# Altium schematic sheet TOP_LEVEL.SchDoc: IGBT Driver
size 420 x 297 mm; ApprovedBy: Chefonov K. A.; Author: Chefonov K. A.; CompanyName: Xtronik; DrawnBy: Chefonov K. A.; Engineer: Chefonov K. A.; Organization: Xtronik; Revision: 1; SheetNumber: 1; SheetTotal: 3
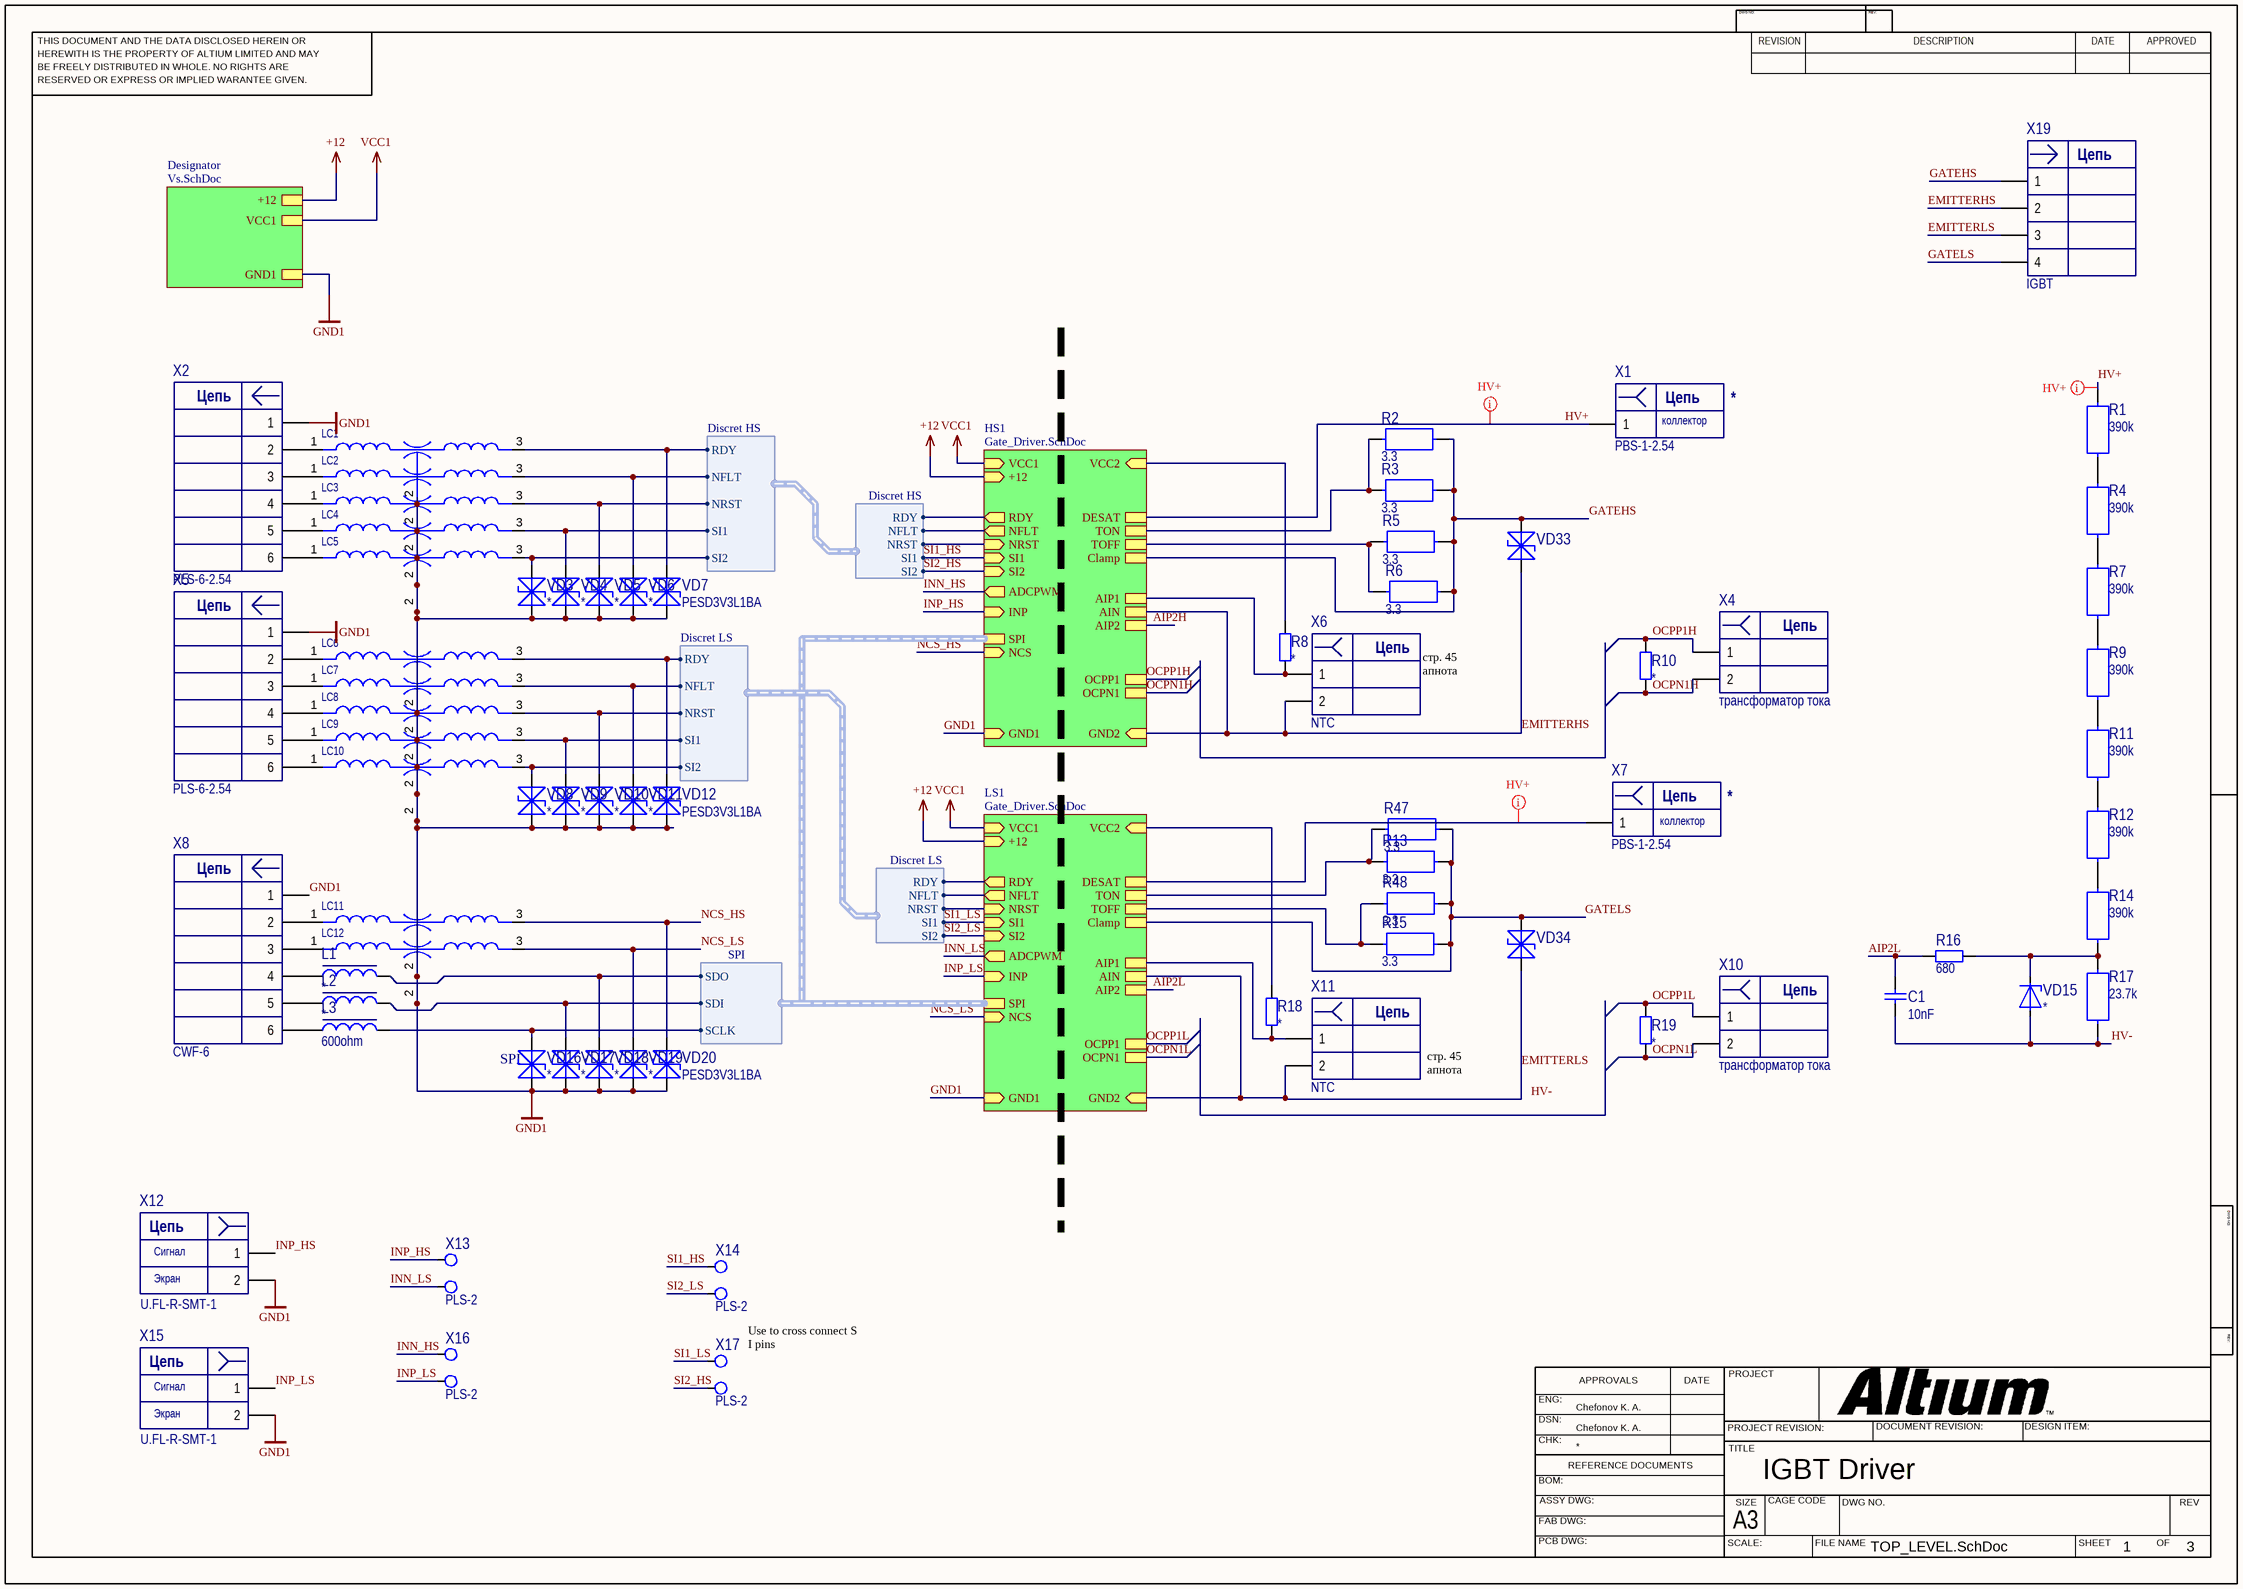
[diagram p0: TOP_LEVEL.SchDoc]

## Parts
C1  10nF  [2012[0805]]
L1  *  [2012[0805]]
L2  *  [2012[0805]]
L3  600ohm  [2012[0805]]
LC1  (no value)  [NFE61PT102E1H9L]
LC2  (no value)  [NFE61PT102E1H9L]
LC3  (no value)  [NFE61PT102E1H9L]
LC4  (no value)  [NFE61PT102E1H9L]
LC5  (no value)  [NFE61PT102E1H9L]
LC6  (no value)  [NFE61PT102E1H9L]
LC7  (no value)  [NFE61PT102E1H9L]
LC8  (no value)  [NFE61PT102E1H9L]
LC9  (no value)  [NFE61PT102E1H9L]
LC10  (no value)  [NFE61PT102E1H9L]
LC11  (no value)  [NFE61PT102E1H9L]
LC12  (no value)  [NFE61PT102E1H9L]
R1  390k  [3225[1210]]
R2  3.3  [2512]
R3  3.3  [2512]
R4  390k  [3225[1210]]
R5  3.3  [2512]
R6  3.3  [2512]
R7  390k  [3225[1210]]
R8  *  [2012[0805]]
R9  390k  [3225[1210]]
R10  *  [2012[0805]]
R11  390k  [3225[1210]]
R12  390k  [3225[1210]]
R13  3.3  [2012[0805]]
R14  390k  [3225[1210]]
R15  3.3  [2012[0805]]
R16  680  [2012[0805]]
R17  23.7k  [2012[0805]]
R18  *  [2012[0805]]
R19  *  [2012[0805]]
R47  3.3  [2012[0805]]
R48  3.3  [2012[0805]]
VD3  *  [SOD-323]
VD4  *  [SOD-323]
VD5  *  [SOD-323]
VD6  *  [SOD-323]
VD7  PESD3V3L1BA  [SOD-323]
VD8  *  [SOD-323]
VD9  *  [SOD-323]
VD10  *  [SOD-323]
VD11  *  [SOD-323]
VD12  PESD3V3L1BA  [SOD-323]
VD15  *  [SOD-123]
VD16  *  [SOD-323]
VD17  *  [SOD-323]
VD18  *  [SOD-323]
VD19  *  [SOD-323]
VD20  PESD3V3L1BA  [SOD-323]
VD33  (no value)  [SMС]
VD34  (no value)  [SMС]
X1  PBS-1-2.54  [PIN_1]
X2  PLS-6-2.54  [CWF-6]
X4  трансформатор тока  [CWF-2]
X5  PLS-6-2.54  [CWF-6]
X6  NTC  [CWF-2]
X7  PBS-1-2.54  [PIN_1]
X8  CWF-6  [CWF-6]
X10  трансформатор тока  [CWF-2]
X11  NTC  [CWF-2]
X12  U.FL-R-SMT-1  [PIN_2]
X13  PLS-2  [PIN_JUMPER]  (no BOM)
X14  PLS-2  [PIN_JUMPER]  (no BOM)
X15  U.FL-R-SMT-1  [PIN_2]
X16  PLS-2  [PIN_JUMPER]  (no BOM)
X17  PLS-2  [PIN_JUMPER]  (no BOM)
X19  IGBT  [IGBT]

## Sub-sheets
Designator = Vs.SchDoc: +12, GND1, VCC1
HS1 = Gate_Driver.SchDoc: GND2 (in), VCC2 (in), VCC1 (in), GND1 (in), TON, TOFF, Clamp, DESAT, OCPP1, OCPN1, AIP1, AIN, AIP2, +12 (in), SI1 (in), SI2 (in), NCS (in), NRST (in), NFLT (out), RDY (out), ADCPWM (out), INP (in), SPI (harness SPI)
LS1 = Gate_Driver.SchDoc: GND2 (in), VCC2 (in), VCC1 (in), GND1 (in), TON, TOFF, Clamp, DESAT, OCPP1, OCPN1, AIP1, AIN, AIP2, +12 (in), SI1 (in), SI2 (in), NCS (in), NRST (in), NFLT (out), RDY (out), ADCPWM (out), INP (in), SPI (harness SPI)

## Harnesses
SPI: SDO, SDI, SCLK
Discret HS: RDY, NFLT, NRST, SI1, SI2
Discret LS: RDY, NFLT, NRST, SI1, SI2

## Nets
+12: sheet HS1/+12, sheet LS1/+12, sheet Designator/+12
GND1: LC1.2(GND) LC2.2(GND) LC3.2(GND) LC4.2(GND) LC5.2(GND) LC6.2(GND) LC7.2(GND) LC8.2(GND) LC9.2(GND) LC10.2(GND) LC11.2(GND) LC12.2(GND) VD3.2(K) VD4.2(K) VD5.2(K) VD6.2(K) VD7.2(K) VD8.2(K) VD9.2(K) VD10.2(K) VD11.2(K) VD12.2(K) VD16.2(K) VD17.2(K) VD18.2(K) VD19.2(K) VD20.2(K) X2.1 X5.1 X8.1 X12.2 X15.2 ; sheet HS1/GND1, sheet LS1/GND1, sheet Designator/GND1
VCC1: sheet HS1/VCC1, sheet LS1/VCC1, sheet Designator/VCC1
AIP2H: sheet HS1/AIP2
AIP2L: C1.1 R16.2 ; sheet LS1/AIP2
EMITTERHS: VD33.2(K) X6.2 X19.2 ; sheet HS1/GND2, sheet HS1/AIN
EMITTERLS: VD34.2(K) X11.2 X19.3 ; sheet LS1/GND2, sheet LS1/AIN
GATEHS: R2.2 R3.2 R5.2 R6.2 VD33.1(A) X19.1 ; sheet HS1/Clamp
GATELS: R13.2 R15.2 R47.2 R48.2 VD34.1(A) X19.4 ; sheet LS1/Clamp
HV+: R1.2 X1.1 ; sheet HS1/DESAT
HV-: C1.2 R17.1 VD15.1(A)
INN_HS: X16.1 ; sheet HS1/ADCPWM
INN_LS: X13.2 ; sheet LS1/ADCPWM
INP_HS: X12.1 X13.1 ; sheet HS1/INP
INP_LS: X15.1 X16.2 ; sheet LS1/INP
NCS_HS: LC11.3(OUTPUT) VD20.1(A) ; sheet HS1/NCS
NCS_LS: LC12.3(OUTPUT) VD19.1(A) ; sheet LS1/NCS
OCPN1H: R10.1 X4.2 ; sheet HS1/OCPN1
OCPN1L: R19.1 X10.2 ; sheet LS1/OCPN1
OCPP1H: R10.2 X4.1 ; sheet HS1/OCPP1
OCPP1L: R19.2 X10.1 ; sheet LS1/OCPP1
SI1_HS: LC4.3(OUTPUT) VD4.1(A) X14.1 ; sheet HS1/SI1, harness Discret HS.SI1
SI1_LS: LC9.3(OUTPUT) VD9.1(A) X17.1 ; sheet LS1/SI1, harness Discret LS.SI1
SI2_HS: LC5.3(OUTPUT) VD3.1(A) X17.2 ; sheet HS1/SI2, harness Discret HS.SI2
SI2_LS: LC10.3(OUTPUT) VD8.1(A) X14.2 ; sheet LS1/SI2, harness Discret LS.SI2
NetL1_1: L1.1 X8.4
NetL1_2: L1.2 VD18.1(A) ; sheet HS1/SPI.SDO
NetL2_1: L2.1 X8.5
NetL2_2: L2.2 VD17.1(A) ; sheet HS1/SPI.SDI
NetL3_1: L3.1 X8.6
NetL3_2: L3.2 VD16.1(A) ; sheet HS1/SPI.SCLK
NetLC1_1: LC1.1(INPUT) X2.2
NetLC1_3: LC1.3(OUTPUT) VD7.1(A) ; sheet HS1/RDY, harness Discret HS.RDY
NetLC2_1: LC2.1(INPUT) X2.3
NetLC2_3: LC2.3(OUTPUT) VD6.1(A) ; sheet HS1/NFLT, harness Discret HS.NFLT
NetLC3_1: LC3.1(INPUT) X2.4
NetLC3_3: LC3.3(OUTPUT) VD5.1(A) ; sheet HS1/NRST, harness Discret HS.NRST
NetLC4_1: LC4.1(INPUT) X2.5
NetLC5_1: LC5.1(INPUT) X2.6
NetLC6_1: LC6.1(INPUT) X5.2
NetLC6_3: LC6.3(OUTPUT) VD12.1(A) ; sheet LS1/RDY, harness Discret LS.RDY
NetLC7_1: LC7.1(INPUT) X5.3
NetLC7_3: LC7.3(OUTPUT) VD11.1(A) ; sheet LS1/NFLT, harness Discret LS.NFLT
NetLC8_1: LC8.1(INPUT) X5.4
NetLC8_3: LC8.3(OUTPUT) VD10.1(A) ; sheet LS1/NRST, harness Discret LS.NRST
NetLC9_1: LC9.1(INPUT) X5.5
NetLC10_1: LC10.1(INPUT) X5.6
NetLC11_1: LC11.1(INPUT) X8.2
NetLC12_1: LC12.1(INPUT) X8.3
NetR1_1: R1.1 R4.2
NetR2_1: R2.1 R3.1 ; sheet HS1/TON
NetR4_1: R4.1 R7.2
NetR5_1: R5.1 R6.1 ; sheet HS1/TOFF
NetR7_1: R7.1 R9.2
NetR8_1: R8.1 X6.1 ; sheet HS1/AIP1
NetR8_2: R8.2 ; sheet HS1/VCC2
NetR9_1: R9.1 R11.2
NetR11_1: R11.1 R12.2
NetR12_1: R12.1 R14.2
NetR13_1: R13.1 R47.1 ; sheet LS1/TON
NetR14_1: R14.1 R16.1 R17.2 VD15.2(K)
NetR15_1: R15.1 R48.1 ; sheet LS1/TOFF
NetR18_1: R18.1 X11.1 ; sheet LS1/AIP1
NetR18_2: R18.2 ; sheet LS1/VCC2
NetX7_1: X7.1 ; sheet LS1/DESAT

## Buses and harness runs
harness sheet HS1/SPI = sheet LS1/SPI

## Layout directives
mark named HV+: HV+, NetX7_1

## Notes on the sheet
- (near X1) коллектор
- стр. 45 апнота
- (near X7) коллектор
- (near VD16) SPI
- Сигнал
- Экран
- Use to cross connect S
  I pins
- Labels drawn without touching a wire or pin: HV-
- THIS DOCUMENT AND THE DATA DISCLOSED HEREIN OR
- HEREWITH IS THE PROPERTY OF ALTIUM LIMITED AND MAY
- DWG NO:
- REVISION
- REV:
- DESCRIPTION
- DATE
- APPROVED
- BE FREELY DISTRIBUTED IN WHOLE. NO RIGHTS ARE
- RESERVED OR EXPRESS OR IMPLIED WARANTEE GIVEN.
- ENG:
- APPROVALS
- PROJECT
- DSN:
- CHK:
- REFERENCE DOCUMENTS
- PROJECT REVISION:
- TITLE
- DOCUMENT REVISION:
- DESIGN ITEM:
- BOM:
- FAB DWG:
- PCB DWG:
- ASSY DWG:
- SCALE:
- A3
- SIZE
- CAGE CODE
- FILE NAME
- DWG NO.
- SHEET
- OF
- REV
- (in symbol XP-PBS-1) Цепь
- (in symbol XP-PBS-2) Цепь
- (in symbol XP-PLD-6) Цепь
- (in symbol XP-PLS-4) Цепь
- (in symbol XP-PLS-6) Цепь

## Library data of the parts
C1 = C-4del: Конденсатор; Manufacturer: Murata; ManufacturerPartNumber: GRM21B X7R 104 50V; Power/Voltage: 50В; Value: 0.1; Tolerance: 10%; TKE/TKC: X7R; Specification: K; BCPId: *; Rem: *; Package: *; Type: Конденсатор; TU/GOST: *; Name: *; HelpURL: *; Price: *
L1-L3 = L with core: Дроссель; Type: Индуктивность; Specification: K; BCPId: *; Power/Voltage: *; Tolerance: *; Manufacturer: *; ManufacturerPartNumber: *; Rem: *; Package: *; Value: *; TU/GOST: *; Name: *; HelpURL: *; Price: *
LC1-LC12 = Фильтр ЭМП LCL
R1-R7 R9 R11-R15 R17 R47 R48 = R: Резистор; Manufacturer: Yageo; ManufacturerPartNumber: RC0805JR-07120R; Power/Voltage: 0.125Вт; Tolerance: 5%; Specification: K; BCPId: *; Rem: *; Package: *; Value: *; TU/GOST: *; Type: Резистор; Name: *; TKE/TKC: *; HelpURL: *; Price: *
R8 R10 R16 R18 R19 = R-4del: Резистор; Manufacturer: Yageo; ManufacturerPartNumber: RC0805JR-07120R; Power/Voltage: 0.125Вт; Tolerance: 5%; Specification: K; BCPId: *; Rem: *; Package: *; Value: *; TU/GOST: *; Type: Резистор; Name: *; TKE/TKC: *; HelpURL: *; Price: *
VD3-VD12 VD16-VD20 VD33 VD34 = VD Stabilitron_bidir: Стабилитрон двусторонний; Specification: K; BCPId: *; Manufacturer: *; Rem: *; Package: *; ManufacturerPartNumber: *; Type: Стабилитрон; TU/GOST: *; HelpURL: *; Price: *
VD15 = VD Stabilitron: Стабилитрон односторонний; Specification: K; BCPId: *; Manufacturer: *; Rem: *; Package: *; ManufacturerPartNumber: *; Type: Стабилитрон; TU/GOST: *; HelpURL: *; Price: *
X1 X7 = XP-PBS-1: Гнездо 1-контакт; Specification: K; BCPId: *; Manufacturer: *; ManufacturerPartNumber: PBS-1-2.54; Rem: *; Package: *; TU/GOST: *; Type: Розетка; HelpURL: *; Price: *; Text: *
X2 X5 = XP-PLS-6: Вилка на 6 контактов; Specification: K; System: Connector; BCPId: *; Manufacturer: *; ManufacturerPartNumber: PLS-6-2.54; Rem: *; Package: *; TU/GOST: *; Type: Вилка; HelpURL: *; Price: *
X4 X6 X10-X12 X15 = XP-PBS-2: Гнездо 2-контакта; ManufacturerPartNumber: PBS-2-2.54; Specification: K; BCPId: *; Manufacturer: *; Rem: *; Package: *; TU/GOST: *; Type: Розетка; HelpURL: *; Price: *
X8 = XP-PLD-6: Вилка 6 контактов в 2 ряда; ManufacturerPartNumber: PLD-6-2.54; Specification: K; System: Connector; BCPId: *; Manufacturer: *; Rem: *; Package: *; TU/GOST: *; Type: Вилка; HelpURL: *; Price: *
X13 X14 X16 X17 = Джампер 2-контакта: Specification: K; BCPId: *; Manufacturer: *; ManufacturerPartNumber: PLS-2; Rem: *; Package: *; TU/GOST: *; Type: Контакты; HelpURL: *; Price: *
X19 = XP-PLS-4: Вилка на 4 контакта; ManufacturerPartNumber: PLS-4-2.54; Specification: K; BCPId: *; Manufacturer: *; Rem: *; Package: *; TU/GOST: *; Type: Вилка; HelpURL: *; Price: *